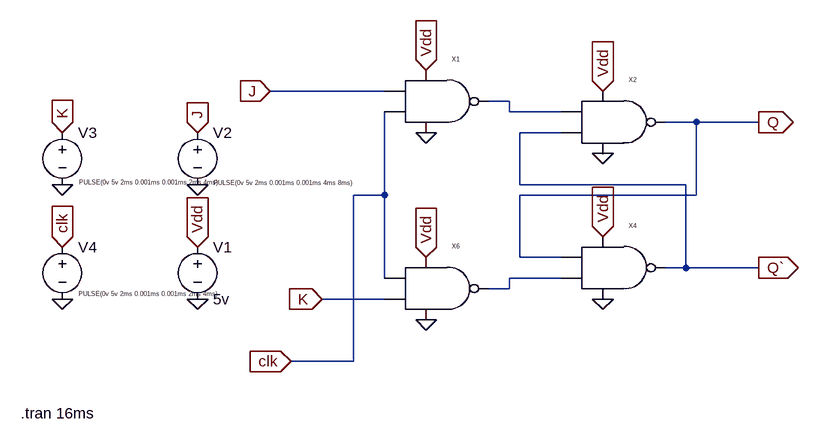
[diagram p0: schematic jk.asc]
jk.asc, the LTspice schematic file:
Version 4
SHEET 1 880 680
WIRE 64 -32 -112 -32
WIRE 256 -16 224 -16
WIRE 256 0 256 -16
WIRE 336 0 256 0
WIRE 544 16 496 16
WIRE 640 16 544 16
WIRE 336 32 272 32
WIRE 272 112 272 32
WIRE 528 112 272 112
WIRE 64 128 64 0
WIRE 64 128 16 128
WIRE 544 128 544 16
WIRE 544 128 272 128
WIRE 272 224 272 128
WIRE 336 224 272 224
WIRE 528 240 528 112
WIRE 528 240 496 240
WIRE 640 240 528 240
WIRE 64 256 64 128
WIRE 336 256 256 256
WIRE 256 272 256 256
WIRE 256 272 224 272
WIRE 64 288 -32 288
WIRE 16 384 16 128
WIRE 16 384 -80 384
FLAG -432 288 0
FLAG -432 112 0
FLAG -224 112 0
FLAG -224 288 0
FLAG 128 32 0
FLAG 128 320 0
FLAG 400 288 0
FLAG 400 64 0
FLAG -224 208 Vdd
IOPIN -224 208 In
FLAG 128 -64 Vdd
IOPIN 128 -64 In
FLAG 400 -32 Vdd
IOPIN 400 -32 In
FLAG 400 192 Vdd
IOPIN 400 192 In
FLAG 128 224 Vdd
IOPIN 128 224 In
FLAG -432 208 clk
IOPIN -432 208 In
FLAG -224 32 J
IOPIN -224 32 In
FLAG -112 -32 J
IOPIN -112 -32 In
FLAG -432 32 K
IOPIN -432 32 In
FLAG -32 288 K
IOPIN -32 288 In
FLAG 640 16 Q
IOPIN 640 16 Out
FLAG 640 240 Q`
IOPIN 640 240 Out
FLAG -80 384 clk
IOPIN -80 384 In
SYMBOL nand 400 16 R0
SYMATTR InstName X2
SYMBOL nand 400 240 R0
SYMATTR InstName X4
SYMBOL voltage -224 192 R0
WINDOW 123 0 0 Left 0
WINDOW 39 0 0 Left 0
SYMATTR InstName V1
SYMATTR Value 5v
SYMBOL voltage -224 16 R0
WINDOW 3 25 93 Left 0
WINDOW 123 0 0 Left 0
WINDOW 39 0 0 Left 0
SYMATTR Value PULSE(0v 5v 2ms 0.001ms 0.001ms 4ms 8ms)
SYMATTR InstName V2
SYMBOL voltage -432 16 R0
WINDOW 3 26 92 Left 0
WINDOW 123 0 0 Left 0
WINDOW 39 0 0 Left 0
SYMATTR Value PULSE(0v 5v 2ms 0.001ms 0.001ms 2ms 4ms)
SYMATTR InstName V3
SYMBOL voltage -432 192 R0
WINDOW 3 25 88 Left 0
WINDOW 123 0 0 Left 0
WINDOW 39 0 0 Left 0
SYMATTR Value PULSE(0v 5v 2ms 0.001ms 0.001ms 2ms 4ms)
SYMATTR InstName V4
SYMBOL nand 128 -16 R0
SYMATTR InstName X1
SYMBOL nand 128 272 R0
SYMATTR InstName X6
TEXT -496 464 Left 2 !.tran 16ms

The netlist it stands for:
* jk.asc
XX2 N001 Q` Vdd 0 Q nand  ; pins A B vdd gnd Y
XX4 Q N002 Vdd 0 Q` nand  ; pins A B vdd gnd Y
V1 Vdd 0 5v
V2 J 0 PULSE(0v 5v 2ms 0.001ms 0.001ms 4ms 8ms)
V3 K 0 PULSE(0v 5v 2ms 0.001ms 0.001ms 2ms 4ms)
V4 clk 0 PULSE(0v 5v 2ms 0.001ms 0.001ms 2ms 4ms)
XX1 J clk Vdd 0 N001 nand  ; pins A B vdd gnd Y
XX6 clk K Vdd 0 N002 nand  ; pins A B vdd gnd Y
.tran 16ms
.backanno
.end